# Altium schematic sheet MicroMultimeter_KEY_Sch.SchDoc: MicroMultimeter - KEY
size 127 x 101 mm; Author: Hom; CompanyName: KitSprout; DrawnBy: Hom; Engineer: Hom; Organization: KitSprout; Revision: A; SheetNumber: 1; SheetTotal: 1; License: CC BY-SA 4.0; Version: 1.0; LibVersion: 1.4; PageSetup: Record=PageOptions|CenterHorizontal=True|CenterVertical=True|PrintScale=1.00|XCorrection=1.00|YCorrection=1.00|PrintKind=0|BorderSize=5000000|LeftOffset=0|BottomOffset=0|Orientation=2|PaperLength=1000|PaperWidth=1000|Scale=100|PaperSource=7|PrintQuality=-3|MediaType=1|DitherType=10|PrintScaleMode=0|PaperKind=A4|PaperIndex=9
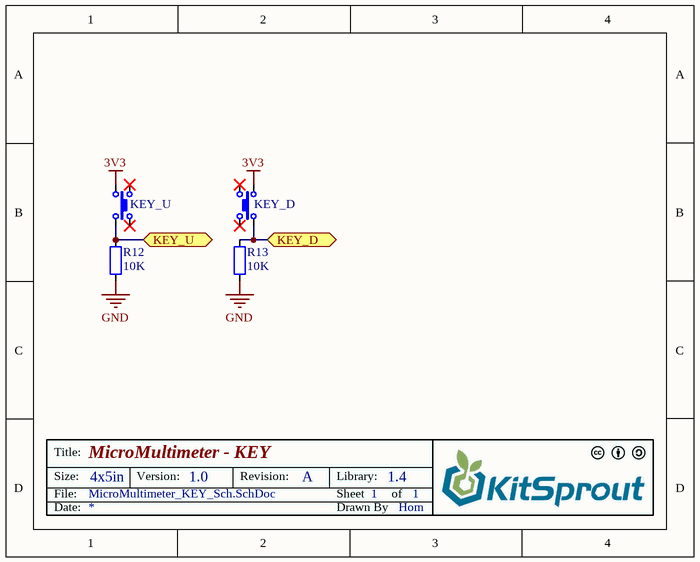
[diagram p0: MicroMultimeter_KEY_Sch.SchDoc]

## Parts
KEY_D  ButtonTACT  [ButtonTACT_3.5*3.55_90]  (value not drawn)
KEY_U  ButtonTACT  [ButtonTACT_3.5*3.55_90]  (value not drawn)
R12  value 10K  [RES_0603]  (hidden comment: Res_0603)
R13  value 10K  [RES_0603]  (hidden comment: Res_0603)

## Ports
KEY_D, KEY_U

## Nets
3V3: KEY_D.4 KEY_U.3
GND: R12.1 R13.1
KEY_D: KEY_D.3 R13.2 ; port KEY_D
KEY_U: KEY_U.4 R12.2 ; port KEY_U

Not connected (* = marked no-connect by the designer): KEY_D 1* 2*; KEY_U 1* 2*

## Notes on the sheet
- Title:
- Size:
- Date:
- File:
- 4x5in
- Version:
- Revision:
- Sheet
- Drawn By
- Library:
- of

## Library data of the parts
KEY_D KEY_U = ButtonTACT: Button
R12 R13 = Res_0603: Resistor